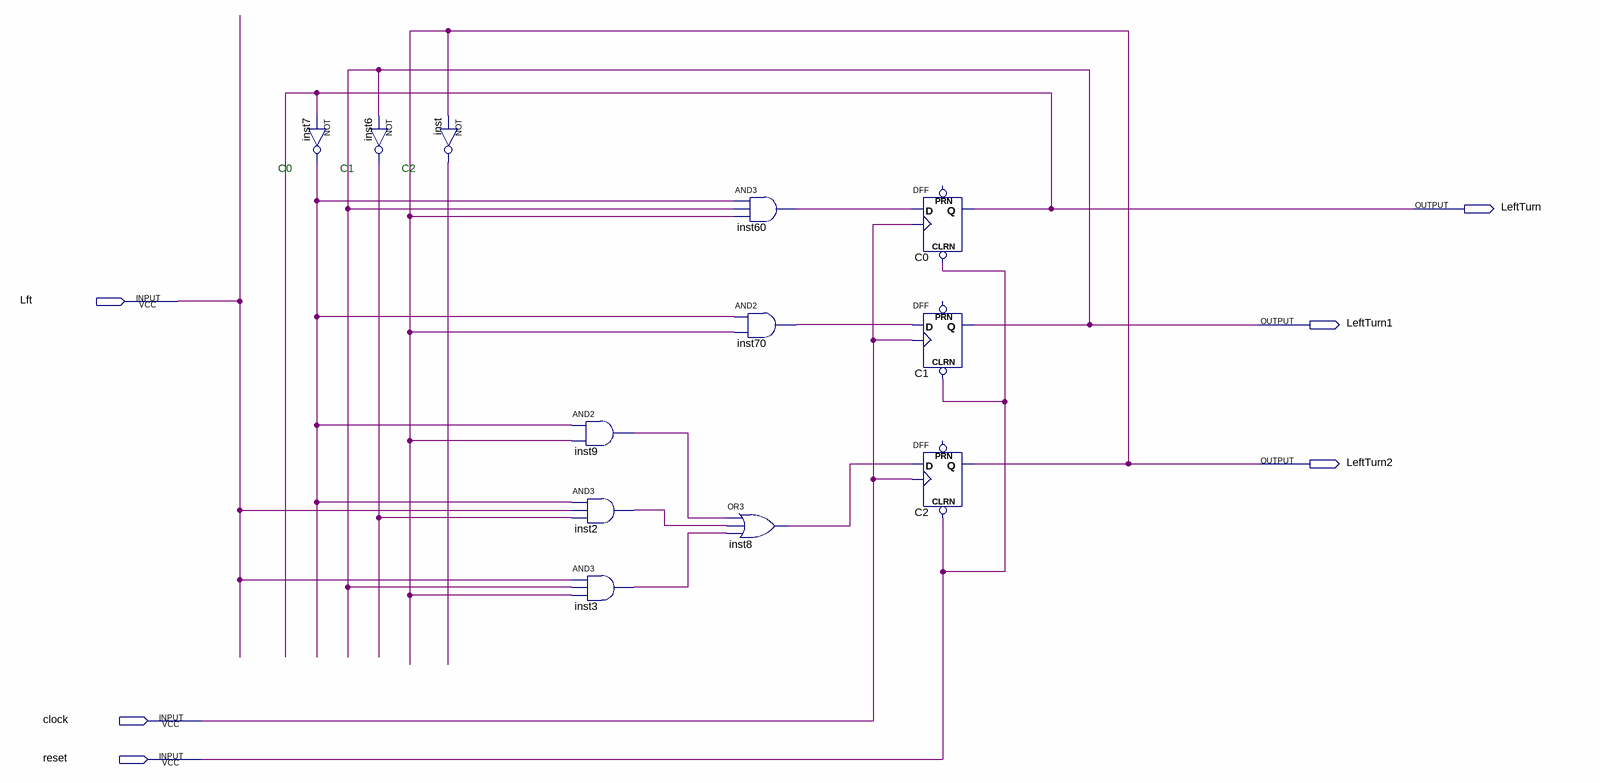
[diagram p0: schematic sheet]
// Quartus schematic ThunderBird.bdf as structural Verilog: 12 symbols, 6 pins
module ThunderBird (
  input  Lft,
  input  clock,
  input  reset,
  output LeftTurn,
  output LeftTurn1,
  output LeftTurn2
);

  wire inst2_out, inst3_out, inst6_out, inst7_out, inst8_out, inst9_out, inst60_out, inst70_out, inst_out;

  not inst7 (inst7_out, LeftTurn);
  not inst6 (inst6_out, LeftTurn1);
  not inst (inst_out, LeftTurn2);
  and inst9 (inst9_out, inst7_out, LeftTurn2);
  and inst2 (inst2_out, inst7_out, Lft, inst6_out);
  and inst3 (inst3_out, Lft, LeftTurn1, LeftTurn2);
  and inst60 (inst60_out, inst7_out, LeftTurn1, LeftTurn2);
  and inst70 (inst70_out, inst7_out, LeftTurn2);
  or inst8 (inst8_out, inst9_out, inst2_out, inst3_out);
  DFF C0 (.CLRN(reset), .CLK(clock), .D(inst60_out), .Q(LeftTurn));  // open: PRN
  DFF C1 (.CLRN(reset), .CLK(clock), .D(inst70_out), .Q(LeftTurn1));  // open: PRN
  DFF C2 (.CLRN(reset), .CLK(clock), .D(inst8_out), .Q(LeftTurn2));  // open: PRN

  // Notes on the sheet:
  //   C0
  //   C1
  //   C2
endmodule
